# Altium schematic sheet Relay_Driver.SchDoc
size B; Author: AM; CompanyName: Expatria Technologies; DrawnBy: A.Marles; Engineer: AM; Organization: Expatria Technolgoies; Address1: PO Box 2084; Address3: Merritt, BC V1K 1B8; Address4: Canada; DocumentNumber: 10; SheetNumber: 10; SheetTotal: 27
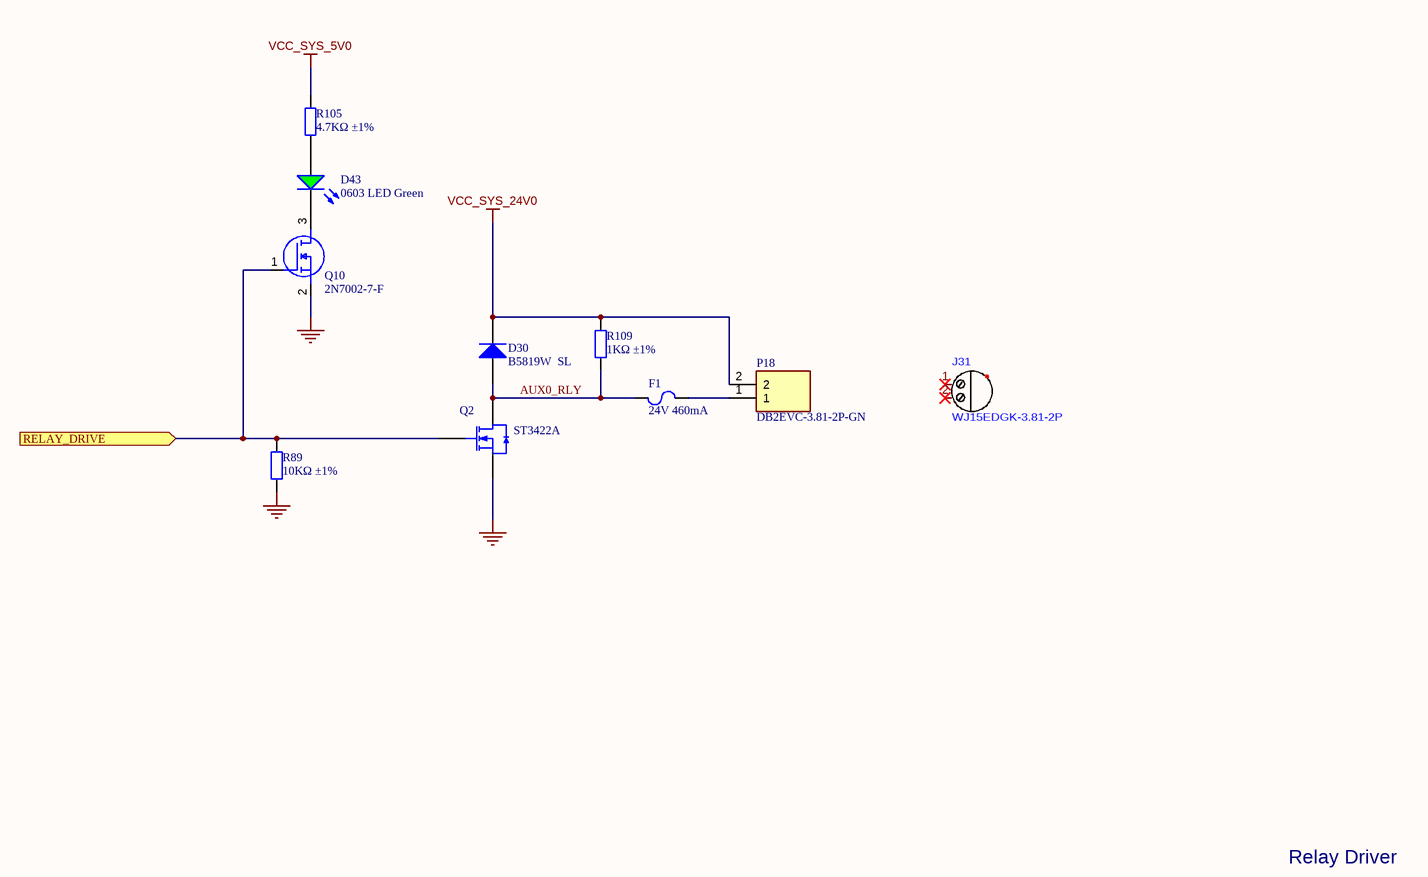
[diagram p0: Relay_Driver.SchDoc]

## Parts
D30  B5819W  SL  [SOD-123]
D43  0603 LED Green  [0603_LED_S1 - GREEN]
F1  24V 460mA  [1206_C]
J31  WJ15EDGK-3.81-2P  (mechanical)
P18  DB2EVC-3.81-2P-GN  [CONN-TH_5P-P3.81_DB2EVC-3.81-2p]
Q2  ST3422A  [SOT-23-3L]
Q10  2N7002-7-F  [SOT-23(SOT-23-3)]
R89  10KΩ ±1%  [0402_R]
R105  4.7KΩ ±1%  [0402_R]
R109  1KΩ ±1%  [0603_R]

## Ports
RELAY_DRIVE (in)

## Nets
GND: Q2.2(S) Q10.2(S) R89.1
VCC_SYS_5V0: R105.2
VCC_SYS_24V0: D30.2(K) P18.2 R109.2
AUX0_RLY: D30.1(A) F1.2 Q2.3(D) R109.1
RELAY_DRIVE: Q2.1(G) Q10.1(G) R89.2 ; port RELAY_DRIVE
NetD43_A: D43.A R105.1
NetD43_K: D43.K Q10.3(D)
NetF1_1: F1.1 P18.1

Not connected (* = marked no-connect by the designer): J31 1* 2*

## Notes on the sheet
- Relay Driver
- SHEET
- Expatria Technologies
- 625 Kane Valley Rd.
- Box 2084
- Merritt, BC V1K1B8
- PROJECT
- SIZE
- ENGR
- MODIFIED
- DOCUMENT
- REV
- Copyright Sienci Labs 2024. This document describes Open Hardware and is licensed under the CERN-OHL-S v2. No warranty is implied or expressed.
- EMAIL: INFO@EXPATRIA.CA
- B
- /

## Library data of the parts
D30 = B5819W  SL: 40V 600mV@1A 1A SOD-123 Schottky Barrier Diodes (SBD) ROHS; Manufacturer: Jiangsu Changjing Electronics Technology Co., Ltd.; ComponentLink1Description: 供应商链接; ComponentLink1URL: http://www.szlcsc.com/product/details_9093.html; Package: SOD-123; Supplier: LC; SuppliersPartNumber: C8598; Manufacturer Part Number: B5819W SL
D43 = MHT192UGCT: 20mA -40℃~+85℃ 515nm~530nm Emerald 120° 60mW 0603 Light Emitting Diodes (LED) ROHS; Manufacturer: MEIHUA; Package: 0603; Supplier: LC; SuppliersPartNumber: C389519; Color: Green; Manufacturer Part Number: MHT192UGCT
F1 = JK-nSMD050-24: 24V 200mA 100A 460mA - Resettable Fuses ROHS; Manufacturer: Jinrui Electronic Materials Co.; PartNumber: JK-nSMD020-24; Package: 1206; Supplier: LC; SuppliersPartNumber: C5307785
J31 = WJ15EDGK-3.81-2P: 2 1 3.81mm Green Plug P=3.81mm Pluggable System Terminal Block ROHS; Manufacturer: Ningbo; Supplier: LCSC; Supplier Part Number 1: C8466; Manufacturer Part Number: WJ15EDGK-3.81-2P; RoHS: Yes; SuppliersPartNumber: C8466
P18 = DB2EVC-3.81-2P-GN: 3.81mm Green Board Edge/Receptacle-Close Push-Pull,P=3.81mm Pluggable System Terminal Block ROHS; Manufacturer: DIBO; SuppliersPartNumber: C395686; Manufacturer Part Number: DB2EVC-3.81-2P-GN; Supplier: LCSC; Value: DB2EVC-3.81-2P-GN
Q2 = ST3422A: 60V 6A 28mΩ@10V,6A 2W 3V@250uA 38pF@15V N Channel 455pF@15V 10nC@10V -55℃~+150℃@(Tj) SOT-23-3L MOSFETs ROHS; Manufacturer: STANSON Tech.; Package: SOT-23; Supplier: LCSC; SuppliersPartNumber: C2682907; Manufacturer Part Number: ST3422A; Value: ST3422A
Q10 = 2N7002-7-F: 60V 115mA 7.5Ω@5V,50mA 370mW N Channel SOT-23 MOSFETs ROHS; Manufacturer: Diodes Inc.; SuppliersPartNumber: C85049; Manufacturer Part Number: 2N7002-7-F; Value: 2N7002-7-F; Datasheet Link: https://datasheet.datasheetarchive.com/originals/distributors/SFDatasheet-0/sf-0003625.pdf; Height: 1.2mm; Manufacturer_Part_Number: 2N7002-7-F; Mouser Part Number: 621-2N7002-F; Mouser Price/Stock: https://www.mouser.co.uk/ProductDetail/Diodes-Incorporated/2N7002-7-F?qs=jMXWnm70%252BC%252BAX%252BMLzUkTZg%3D%3D; Arrow Part Number: 2N7002-7-F; Arrow Price/Stock: https://www.arrow.com/en/products/2n7002-7-f/diodes-incorporated?region=nac
R89 = 0402 10K (1002) 1%: Chip resistor; Manufacturer: Uniroyal Elec; Manufacturer Part Number: 0402WGF1002TCE; Power: 1/16W; ComponentLink1Description: Supplier link; ComponentLink1URL: http://www.szlcsc.com/product/details_26487.html; Package: 0402; Supplier: LC; SuppliersPartNumber: C25744; Resistance: 10KΩ; Tolerance: 1%
R105 = 0402 4.7K (4701) 1%: Chip resistor; Manufacturer: Uniroyal Elec; Manufacturer Part Number: 0402WGF4701TCE; Power: 1/16W; ComponentLink1Description: Supplier link; ComponentLink1URL: http://www.szlcsc.com/product/details_26643.html; Package: 0402; Supplier: LC; SuppliersPartNumber: C25900; Resistance: 4.7KΩ; Tolerance: 1%
R109 = 0603 1K (1001) 1%: Chip resistor; Manufacturer: Uniroyal Elec; Manufacturer Part Number: 0603WAF1001T5E; Power: 1/10W; ComponentLink1Description: Supplier link; ComponentLink1URL: http://www.szlcsc.com/product/details_21904.html; Package: 0603; Supplier: LC; SuppliersPartNumber: C21190; Resistance: 1KΩ; Tolerance: 1%